# Altium schematic sheet 05_DATA_IO.SchDoc
size A3
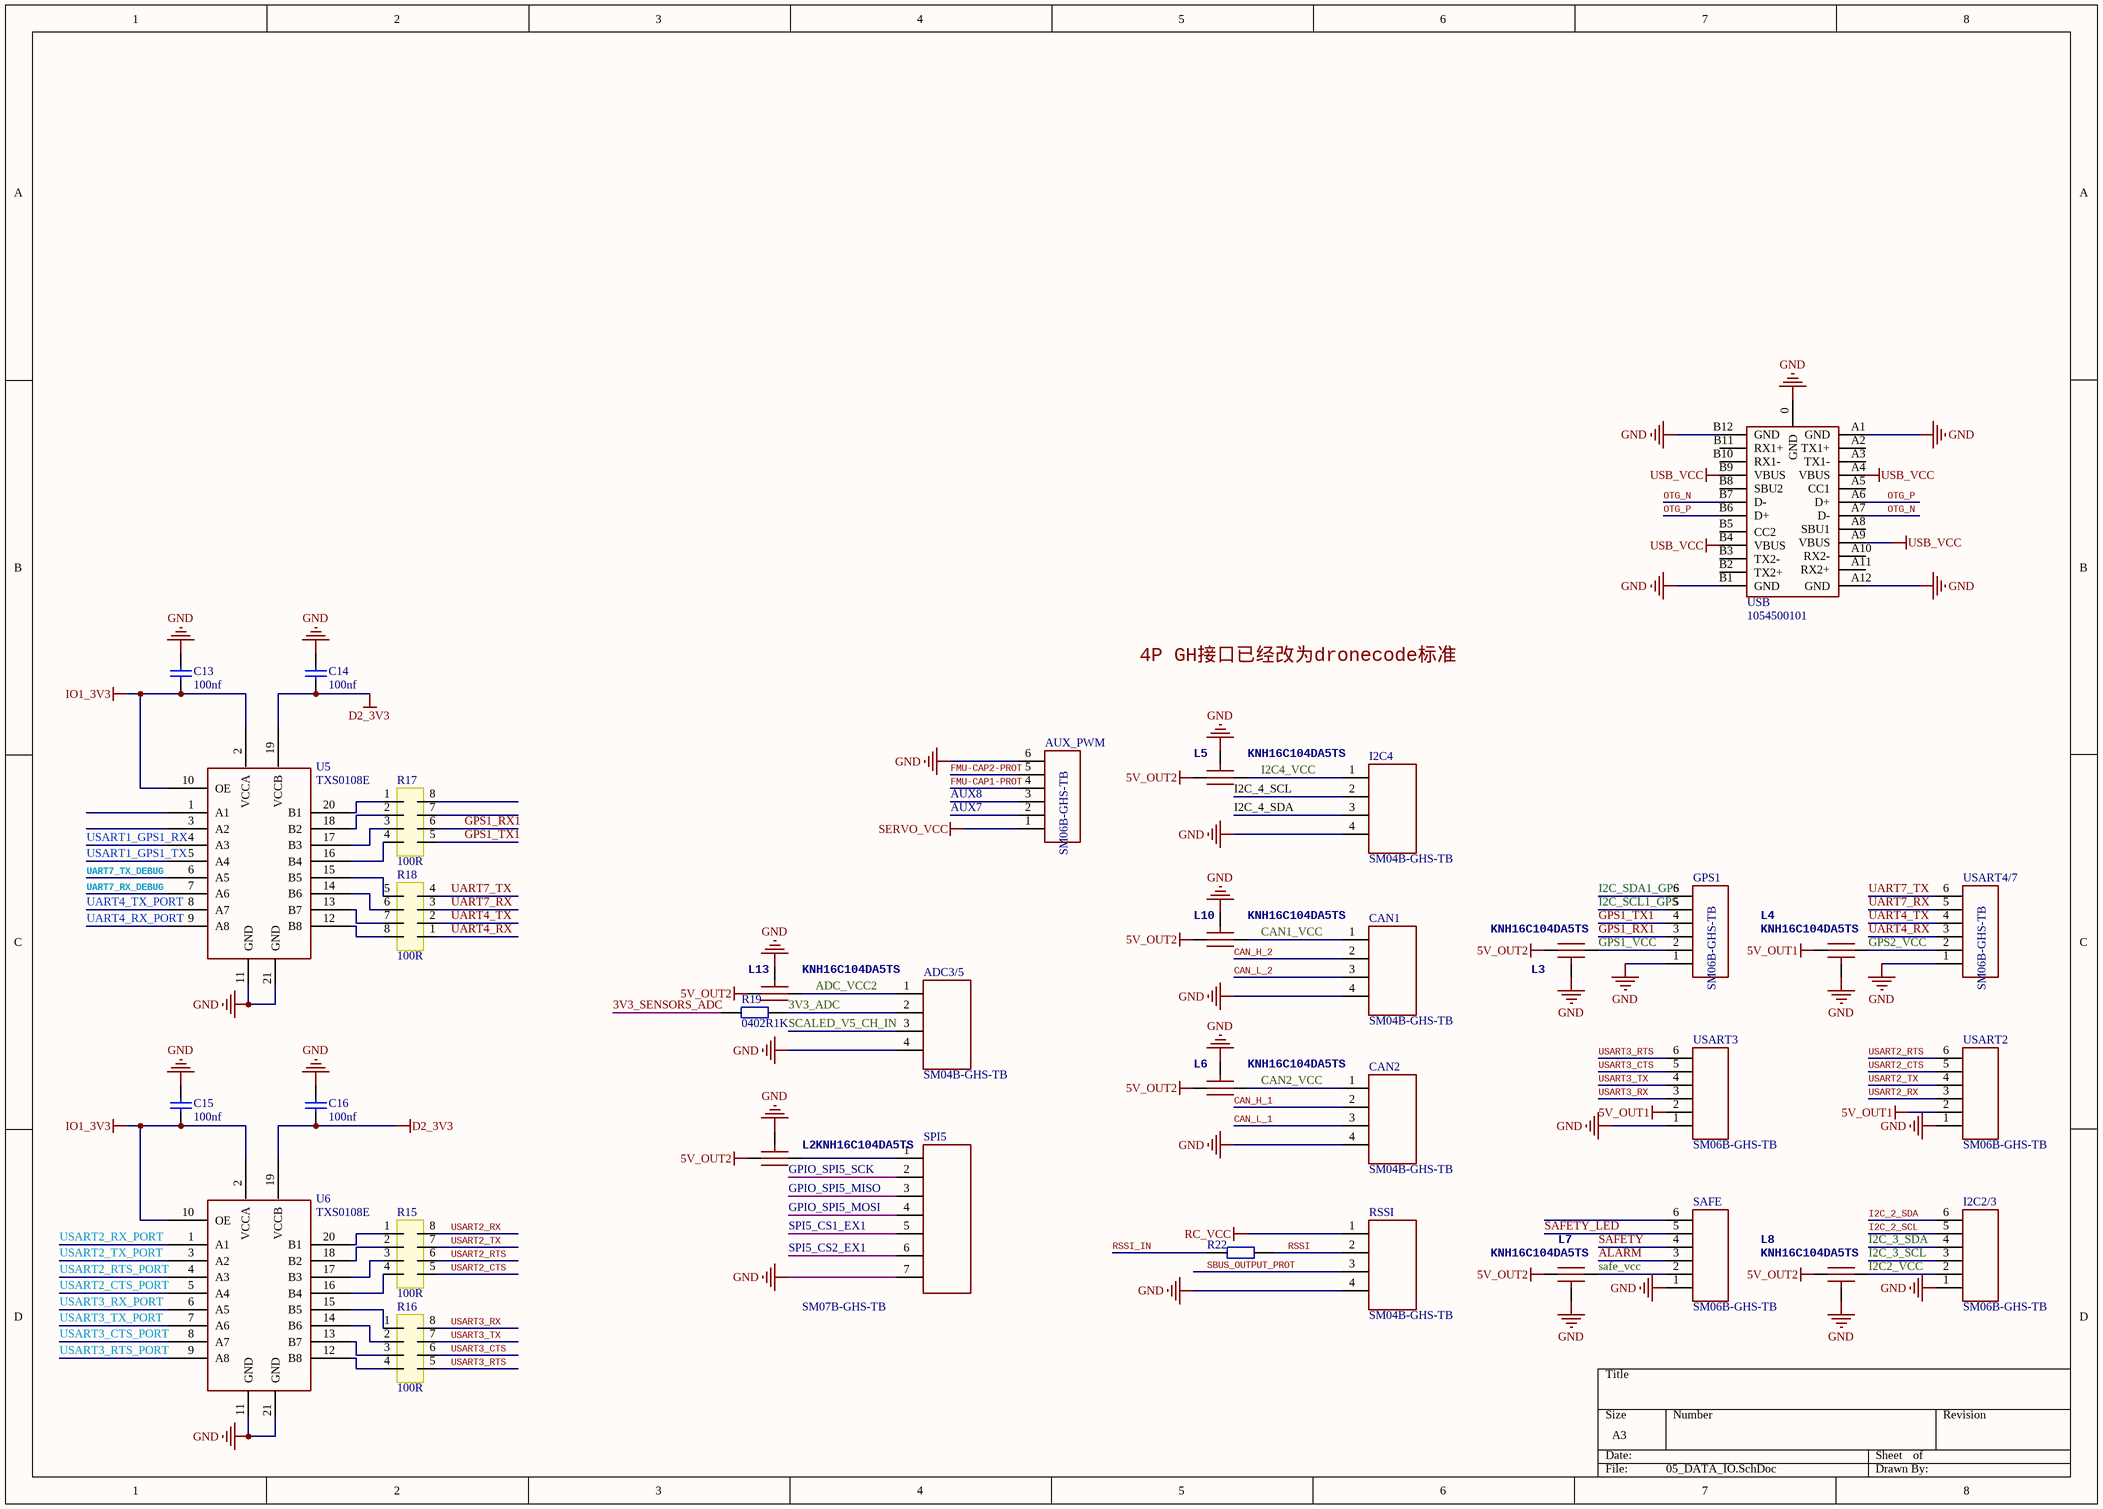
[diagram p0: 05_DATA_IO.SchDoc]

## Parts
ADC3/5  SM04B-GHS-TB  [BM04B-GHS_DC]
AUX_PWM  SM06B-GHS-TB  [BM06B-GHS_DC]
C13  100nf  [0402CAP]
C14  100nf  [0402CAP]
C15  100nf  [0402CAP]
C16  100nf  [0402CAP]
CAN1  SM04B-GHS-TB  [BM04B-GHS_DC]
CAN2  SM04B-GHS-TB  [BM04B-GHS_DC]
GPS1  SM06B-GHS-TB  [SM06B-GHS-TB]
I2C2/3  SM06B-GHS-TB  [SM06B-GHS-TB]
I2C4  SM04B-GHS-TB  [BM04B-GHS_DC]
L2  KNH16C104DA5TS  [KYOCERA-KNH16-DA]
L3  KNH16C104DA5TS  [KYOCERA-KNH16-DA]
L4  KNH16C104DA5TS  [KYOCERA-KNH16-DA]
L5  KNH16C104DA5TS  [KYOCERA-KNH16-DA]
L6  KNH16C104DA5TS  [KYOCERA-KNH16-DA]
L7  KNH16C104DA5TS  [KYOCERA-KNH16-DA]
L8  KNH16C104DA5TS  [KYOCERA-KNH16-DA]
L10  KNH16C104DA5TS  [KYOCERA-KNH16-DA]
L13  KNH16C104DA5TS  [KYOCERA-KNH16-DA]
R15  100R  [0402_4r]
R16  100R  [0402_4r]
R17  100R  [0402_4r]
R18  100R  [0402_4r]
R19  0402R1K  [0402R]
R22  0402R100R  [0402R]  (value not drawn)
RSSI  SM04B-GHS-TB  [BM04B-GHS_DC]
SAFE  SM06B-GHS-TB  [SM06B-GHS-TB]
SPI5  SM07B-GHS-TB  [SM07B-GHS]
U5  TXS0108E  [VQFN20]
U6  TXS0108E  [VQFN20]
USART2  SM06B-GHS-TB  [SM06B-GHS-TB]
USART3  SM06B-GHS-TB  [SM06B-GHS-TB]
USART4/7  SM06B-GHS-TB  [SM06B-GHS-TB]
USB  1054500101  [1054500101]

## Nets
5V_OUT1: L4.P$1 USART2.2 USART3.2
5V_OUT2: L2.P$2 L3.P$1 L5.P$2 L6.P$2 L7.P$1 L8.P$1 L10.P$2 L13.P$2
D2_3V3: C14.2 C16.2 U5.19(VCCB) U6.19(VCCB)
GND: ADC3/5.4 AUX_PWM.6 C13.1 C14.1 C15.1 C16.1 CAN1.4 CAN2.4 GPS1.1 I2C2/3.1 I2C4.4 L2.GND L3.GND L4.GND L5.GND L6.GND L7.GND L8.GND L10.GND L13.GND RSSI.4 SAFE.1 SPI5.7 U5.11(GND) U5.21(GND) U6.11(GND) U6.21(GND) USART2.1 USART3.1 USART4/7.1 USB.0(GND) USB.A1(GND) USB.A12(GND) USB.B1(GND) USB.B12(GND)
IO1_3V3: C13.2 C15.2 U5.2(VCCA) U5.10(OE) U6.2(VCCA) U6.10(OE)
RC_VCC: RSSI.1
SERVO_VCC: AUX_PWM.1
USB_VCC: USB.A4(VBUS) USB.A9(VBUS) USB.B4(VBUS) USB.B9(VBUS)
3V3_ADC: ADC3/5.2 R19.2
3V3_SENSORS_ADC: R19.1
ADC_VCC2: ADC3/5.1 L13.P$1
ALARM: SAFE.3
AUX7: AUX_PWM.2
AUX8: AUX_PWM.3
CAN1_VCC: CAN1.1 L10.P$1
CAN2_VCC: CAN2.1 L6.P$1
CAN_H_1: CAN2.2
CAN_H_2: CAN1.2
CAN_L_1: CAN2.3
CAN_L_2: CAN1.3
FMU-CAP1-PROT: AUX_PWM.4
FMU-CAP2-PROT: AUX_PWM.5
GPIO_SPI5_MISO: SPI5.3
GPIO_SPI5_MOSI: SPI5.4
GPIO_SPI5_SCK: SPI5.2
GPS1_RX1: GPS1.3 R17.6
GPS1_TX1: GPS1.4 R17.5
GPS1_VCC: GPS1.2 L3.P$2
GPS2_VCC: L4.P$2 USART4/7.2
I2C2_VCC: I2C2/3.2 L8.P$2
I2C4_VCC: I2C4.1 L5.P$1
I2C_2_SCL: I2C2/3.5
I2C_2_SDA: I2C2/3.6
I2C_3_SCL: I2C2/3.3
I2C_3_SDA: I2C2/3.4
I2C_4_SCL: I2C4.2
I2C_4_SDA: I2C4.3
I2C_SCL1_GPS: GPS1.5
I2C_SDA1_GPS: GPS1.6
OTG_N: USB.A7(D-) USB.B7(D-)
OTG_P: USB.A6(D+) USB.B6(D+)
RSSI: R22.2 RSSI.2
RSSI_IN: R22.1
safe_vcc: L7.P$2 SAFE.2
SAFETY: SAFE.4
SAFETY_LED: SAFE.5
SBUS_OUTPUT_PROT: RSSI.3
SCALED_V5_CH_IN: ADC3/5.3
SPI5_CS1_EX1: SPI5.5
SPI5_CS2_EX1: SPI5.6
UART4_RX: R18.1 USART4/7.3
UART4_RX_PORT: U5.9(A8)
UART4_TX: R18.2 USART4/7.4
UART4_TX_PORT: U5.8(A7)
UART7_RX: R18.3 USART4/7.5
UART7_RX_DEBUG: U5.7(A6)
UART7_TX: R18.4 USART4/7.6
UART7_TX_DEBUG: U5.6(A5)
USART1_GPS1_RX: U5.4(A3)
USART1_GPS1_TX: U5.5(A4)
USART2_CTS: R15.5 USART2.5
USART2_CTS_PORT: U6.5(A4)
USART2_RTS: R15.6 USART2.6
USART2_RTS_PORT: U6.4(A3)
USART2_RX: R15.8 USART2.3
USART2_RX_PORT: U6.1(A1)
USART2_TX: R15.7 USART2.4
USART2_TX_PORT: U6.3(A2)
USART3_CTS: R16.6 USART3.5
USART3_CTS_PORT: U6.8(A7)
USART3_RTS: R16.5 USART3.6
USART3_RTS_PORT: U6.9(A8)
USART3_RX: R16.8 USART3.3
USART3_RX_PORT: U6.6(A5)
USART3_TX: R16.7 USART3.4
USART3_TX_PORT: U6.7(A6)
NetL2_P$1: L2.P$1 SPI5.1
NetR15_1: R15.1 U6.20(B1)
NetR15_2: R15.2 U6.18(B2)
NetR15_3: R15.3 U6.17(B3)
NetR15_4: R15.4 U6.16(B4)
NetR16_1: R16.1 U6.15(B5)
NetR16_2: R16.2 U6.14(B6)
NetR16_3: R16.3 U6.13(B7)
NetR16_4: R16.4 U6.12(B8)
NetR17_1: R17.1 U5.20(B1)
NetR17_2: R17.2 U5.18(B2)
NetR17_3: R17.3 U5.17(B3)
NetR17_4: R17.4 U5.16(B4)
NetR18_5: R18.5 U5.15(B5)
NetR18_6: R18.6 U5.14(B6)
NetR18_7: R18.7 U5.13(B7)
NetR18_8: R18.8 U5.12(B8)

Not connected (* = marked no-connect by the designer): R17 7 8; SAFE 6; U5 1(A1) 3(A2); USB A2(TX1+) A3(TX1-) A5(CC1) A8(SBU1) A10(RX2-) A11(RX2+) B2(TX2+) B3(TX2-) B5(CC2) B8(SBU2) B10(RX1-) B11(RX1+)

## Notes on the sheet
- Labels drawn without touching a wire or pin: 4P GH接口已经改为dronecode标准

## Library data of the parts
AUX_PWM = SM06B-GHS-TB: dronecode
C13-C16 = Cap
CAN1 CAN2 I2C4 RSSI = SM04B-GHS-TB: dronecode
L2-L8 L10 L13 = KNH16C104DA5TS: Capacitor, Filter, 0.1uF, 25V, 2A, 0603, SMD; 3DR_PARTNO: ECM0719; Supplier 1: Digi-Key
R15-R18 = 0402-8R-4R
R19 = 0402R1K: 0402R1K 1%
R22 = 0402R100R: 0402R100R 1%